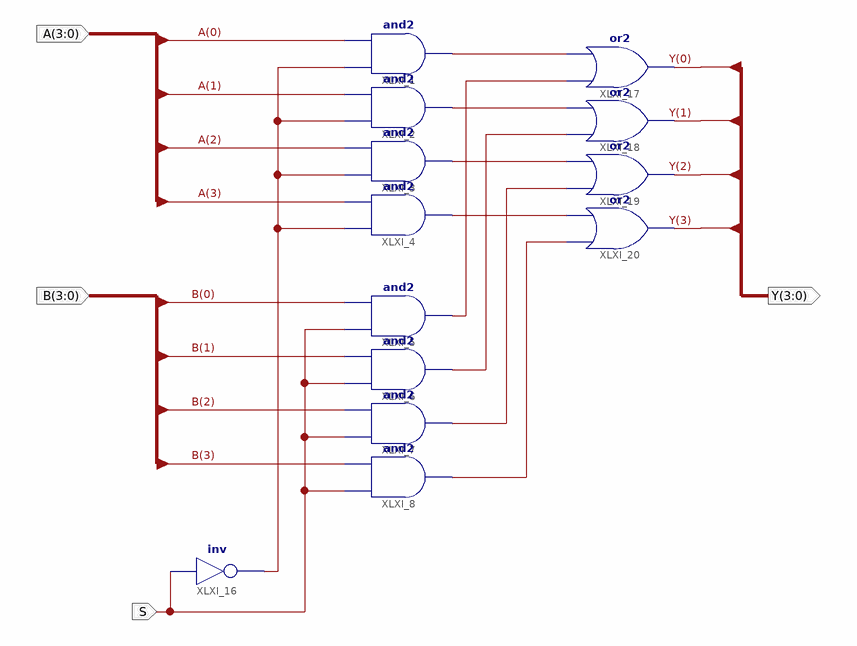
[diagram p0: schematic sheet 1]
// Xilinx ISE schematic Mux2_1_4.sch (spartan6) as structural Verilog: 13 symbols, 4 ports
module Mux2_1_4 (
  input  S,
  input  [3:0] A,
  input  [3:0] B,
  output [3:0] Y
);

  wire XLXN_32, XLXN_33, XLXN_34, XLXN_35, XLXN_36, XLXN_37, XLXN_38, XLXN_39, XLXN_40;

  and XLXI_1 (XLXN_33, XLXN_32, A[0]);
  and XLXI_2 (XLXN_34, XLXN_32, A[1]);
  and XLXI_3 (XLXN_35, XLXN_32, A[2]);
  and XLXI_4 (XLXN_36, XLXN_32, A[3]);
  and XLXI_5 (XLXN_37, S, B[0]);
  and XLXI_6 (XLXN_38, S, B[1]);
  and XLXI_7 (XLXN_39, S, B[2]);
  and XLXI_8 (XLXN_40, S, B[3]);
  not XLXI_16 (XLXN_32, S);
  or XLXI_17 (Y[0], XLXN_37, XLXN_33);
  or XLXI_18 (Y[1], XLXN_38, XLXN_34);
  or XLXI_19 (Y[2], XLXN_39, XLXN_35);
  or XLXI_20 (Y[3], XLXN_40, XLXN_36);
endmodule
